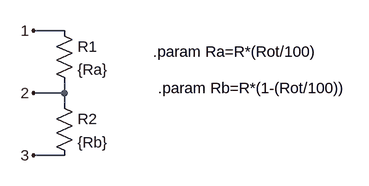
[diagram p0: schematic pot_lin.asc]
pot_lin.asc, the LTspice schematic file:
Version 4
SHEET 1 5632 1784
WIRE 608 -512 560 -512
WIRE 608 -416 608 -432
WIRE 608 -416 560 -416
WIRE 608 -400 608 -416
WIRE 608 -320 560 -320
FLAG 560 -512 1
FLAG 560 -416 2
FLAG 560 -320 3
SYMBOL res 592 -528 R0
SYMATTR InstName R1
SYMATTR Value {Ra}
SYMBOL res 592 -416 R0
SYMATTR InstName R2
SYMATTR Value {Rb}
TEXT 744 -480 Left 2 !.param Ra=R*(Rot/100)
TEXT 752 -424 Left 2 !.param Rb=R*(1-(Rot/100))

The netlist it stands for:
* pot_lin.asc
R1 1 2 {Ra}
R2 2 3 {Rb}
.param Ra=R*(Rot/100)
.param Rb=R*(1-(Rot/100))
.backanno
.end